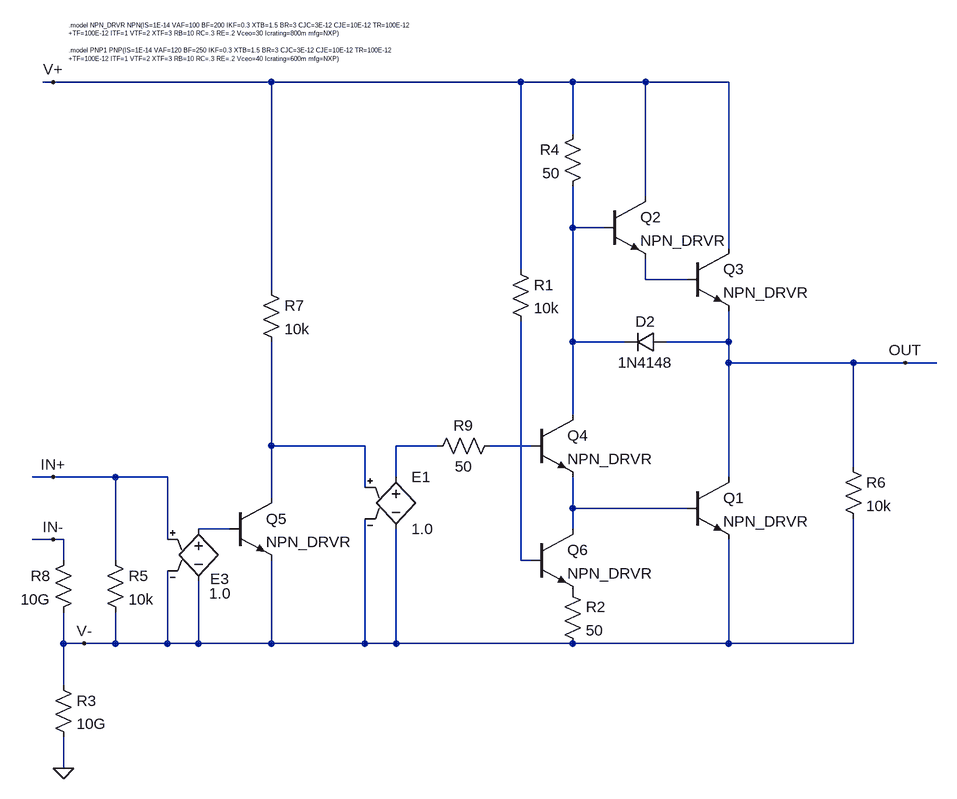
[diagram p0: schematic Output_Stage_Transistor_Level.asc]
Output_Stage_Transistor_Level.asc, the LTspice schematic file:
Version 4.1
SHEET 1 6960 2676
WIRE 1216 464 1200 464
WIRE 1552 464 1216 464
WIRE 1936 464 1552 464
WIRE 2016 464 1936 464
WIRE 2128 464 2016 464
WIRE 2256 464 2128 464
WIRE 2016 544 2016 464
WIRE 2128 640 2128 464
WIRE 2016 688 2016 624
WIRE 2064 688 2016 688
WIRE 2256 720 2256 464
WIRE 1936 752 1936 464
WIRE 2128 768 2128 736
WIRE 2192 768 2128 768
WIRE 1552 784 1552 464
WIRE 2016 864 2016 688
WIRE 2096 864 2016 864
WIRE 2256 864 2256 816
WIRE 2256 864 2160 864
WIRE 2256 896 2256 864
WIRE 2448 896 2256 896
WIRE 2528 896 2448 896
WIRE 2576 896 2528 896
WIRE 2016 976 2016 864
WIRE 1552 1024 1552 864
WIRE 1696 1024 1552 1024
WIRE 1808 1024 1744 1024
WIRE 1952 1024 1888 1024
WIRE 2448 1056 2448 896
WIRE 1216 1072 1184 1072
WIRE 1312 1072 1216 1072
WIRE 1392 1072 1312 1072
WIRE 1744 1072 1744 1024
WIRE 2256 1072 2256 896
WIRE 1696 1088 1696 1024
WIRE 1552 1104 1552 1024
WIRE 2016 1120 2016 1072
WIRE 2192 1120 2016 1120
WIRE 1488 1152 1440 1152
WIRE 2016 1152 2016 1120
WIRE 1216 1168 1184 1168
WIRE 1232 1168 1216 1168
WIRE 1392 1168 1392 1072
WIRE 1232 1200 1232 1168
WIRE 1312 1200 1312 1072
WIRE 1936 1200 1936 832
WIRE 1952 1200 1936 1200
WIRE 1232 1328 1232 1280
WIRE 1264 1328 1232 1328
WIRE 1312 1328 1312 1280
WIRE 1312 1328 1264 1328
WIRE 1392 1328 1392 1216
WIRE 1392 1328 1312 1328
WIRE 1440 1328 1440 1232
WIRE 1440 1328 1392 1328
WIRE 1552 1328 1552 1200
WIRE 1552 1328 1440 1328
WIRE 1696 1328 1696 1136
WIRE 1696 1328 1552 1328
WIRE 1744 1328 1744 1152
WIRE 1744 1328 1696 1328
WIRE 2016 1328 1744 1328
WIRE 2256 1328 2256 1168
WIRE 2256 1328 2016 1328
WIRE 2448 1328 2448 1136
WIRE 2448 1328 2256 1328
WIRE 1232 1392 1232 1328
WIRE 1232 1520 1232 1472
FLAG 1216 1072 IN+
FLAG 2528 896 OUT
FLAG 1232 1520 0
FLAG 1216 464 V+
FLAG 1216 1168 IN-
FLAG 1264 1328 V-
SYMBOL npn 2064 640 R0
SYMATTR InstName Q2
SYMATTR Value NPN_DRVR
SYMBOL npn 2192 720 R0
SYMATTR InstName Q3
SYMATTR Value NPN_DRVR
SYMBOL diode 2160 848 R90
WINDOW 0 0 32 VBottom 2
WINDOW 3 32 32 VTop 2
SYMATTR InstName D2
SYMATTR Value 1N4148
SYMBOL e 1744 1056 R0
SYMATTR InstName E1
SYMATTR Value 1.0
SYMBOL res 1296 1184 R0
SYMATTR InstName R5
SYMATTR Value 10k
SYMBOL res 2432 1040 R0
SYMATTR InstName R6
SYMATTR Value 10k
SYMBOL res 2032 528 M0
SYMATTR InstName R4
SYMATTR Value 50
SYMBOL npn 1488 1104 R0
SYMATTR InstName Q5
SYMATTR Value NPN_DRVR
SYMBOL res 1536 768 R0
SYMATTR InstName R7
SYMATTR Value 10k
SYMBOL e 1440 1136 R0
WINDOW 0 18 93 Left 2
WINDOW 3 16 115 Left 2
SYMATTR InstName E3
SYMATTR Value 1.0
SYMBOL res 1904 1008 R90
WINDOW 0 0 56 VBottom 2
WINDOW 3 32 56 VTop 2
SYMATTR InstName R9
SYMATTR Value 50
SYMBOL npn 2192 1072 R0
SYMATTR InstName Q1
SYMATTR Value NPN_DRVR
SYMBOL npn 1952 976 R0
SYMATTR InstName Q4
SYMATTR Value NPN_DRVR
SYMBOL npn 1952 1152 R0
SYMATTR InstName Q6
SYMATTR Value NPN_DRVR
SYMBOL res 1920 736 R0
SYMATTR InstName R1
SYMATTR Value 10k
SYMBOL res 2000 1232 R0
SYMATTR InstName R2
SYMATTR Value 50
SYMBOL res 1216 1376 R0
SYMATTR InstName R3
SYMATTR Value 10G
SYMBOL res 1248 1184 M0
SYMATTR InstName R8
SYMATTR Value 10G
TEXT 1240 376 Left 0 !.model NPN_DRVR NPN(IS=1E-14 VAF=100 BF=200 IKF=0.3 XTB=1.5 BR=3 CJC=3E-12 CJE=10E-12 TR=100E-12 \n+TF=100E-12 ITF=1 VTF=2 XTF=3 RB=10 RC=.3 RE=.2 Vceo=30 Icrating=800m mfg=NXP)\n \n.model PNP1 PNP(IS=1E-14 VAF=120 BF=250 IKF=0.3 XTB=1.5 BR=3 CJC=3E-12 CJE=10E-12 TR=100E-12 \n+TF=100E-12 ITF=1 VTF=2 XTF=3 RB=10 RC=.3 RE=.2 Vceo=40 Icrating=600m mfg=NXP)

The netlist it stands for:
* Output_Stage_Transistor_Level.asc
Q2 V+ N001 N002 0 NPN_DRVR
Q3 V+ N002 OUT 0 NPN_DRVR
D2 OUT N001 1N4148
E1 N004 V- N003 V- 1.0
R5 IN+ V- 10k
R6 OUT V- 10k
R4 V+ N001 50
Q5 N003 N007 V- 0 NPN_DRVR
R7 V+ N003 10k
E3 N007 V- IN+ V- 1.0
R9 N005 N004 50
Q1 OUT N006 V- 0 NPN_DRVR
Q4 N001 N005 N006 0 NPN_DRVR
Q6 N006 N008 P001 0 NPN_DRVR
R1 V+ N008 10k
R2 P001 V- 50
R3 V- 0 10G
R8 IN- V- 10G
.model D D
.lib standard.dio
.model NPN NPN
.model PNP PNP
.lib standard.bjt
.model NPN_DRVR NPN(IS=1E-14 VAF=100 BF=200 IKF=0.3 XTB=1.5 BR=3 CJC=3E-12 CJE=10E-12 TR=100E-12
+TF=100E-12 ITF=1 VTF=2 XTF=3 RB=10 RC=.3 RE=.2 Vceo=30 Icrating=800m mfg=NXP)
.model PNP1 PNP(IS=1E-14 VAF=120 BF=250 IKF=0.3 XTB=1.5 BR=3 CJC=3E-12 CJE=10E-12 TR=100E-12
+TF=100E-12 ITF=1 VTF=2 XTF=3 RB=10 RC=.3 RE=.2 Vceo=40 Icrating=600m mfg=NXP)
.backanno
.end